# Altium schematic sheet RELAY6.SchDoc
size A
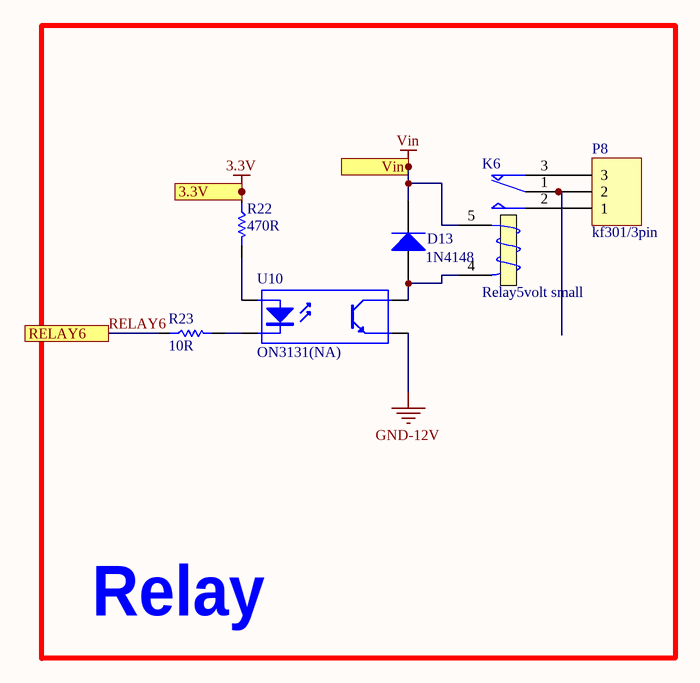
[diagram p0: RELAY6.SchDoc]

## Parts
D13  1N4148  [sod123]
K6  Relay5volt small  [relay5_childern]
P8  kf301/3pin  [Blue Connector 1*3 -kf301]
R22  470R  [0805/resistor]
R23  10R  [0805/resistor]
U10  ON3131(NA)  [OPTO_COUPLER]

## Blocks framed on the sheet
Relay: D13 K6 P8 R22 R23 U10

## Ports
3.3V, RELAY6, Vin

## Nets
3.3V: R22.1 ; port 3.3V
GND-12V: U10.3(E)
Vin: D13.K K6.5 ; port Vin
RELAY6: R23.1 ; port RELAY6
NetD13_A: D13.A K6.4(T2) U10.4(C)
NetK6_1: K6.1(COM) P8.2
NetK6_2: K6.2(NO) P8.1
NetK6_3: K6.3(T1) P8.3
NetR22_2: R22.2 U10.1(A)
NetR23_2: R23.2 U10.2(K)

## Library data of the parts
D13 = Diode 1N4007: 1 Amp General Purpose Rectifier; Published: 8-Jun-2000; LatestRevisionDate: 17-Jul-2002; LatestRevisionNote: Re-released for DXP Platform.; DatasheetVersion: 1998; PackageVersion: Aug-1999; PackageReference: DO-41; Publisher: Altium Limited; PackageDescription: Diode, Axial; Body 5.2 x 2.7 mm (LxDia. max), Lead Dia. 0.86 mm (max); Code_JEDEC: DO-204-AL; ComponentLink1Description: Manufacturer Link; ComponentLink1URL: http://www.fairchildsemi.com/; ComponentLink2Description: Datasheet; ComponentLink2URL: http://www.fairchildsemi.com/ds/1N%2F1N4001.pdf
K6 = Relay: SPDT Relay; Published: 8-Jun-2000; LatestRevisionDate: 17-Jul-2002; LatestRevisionNote: Re-released for DXP Platform.; PackageReference: MODULE5B; Publisher: Altium Limited
P8 = Header 3: LatestRevisionDate: 17-Jul-2002; LatestRevisionNote: Re-released for DXP Platform.; Publisher: Altium Limited
R22 R23 = Resistor: Tolerance: 5%; Power: 1/8 W
  R22: Value: 470R
  R23: Value: 10R
U10 = Optoisolator1: 4-Pin Phototransistor Optocoupler; Published: 24-Mar-1999; LatestRevisionDate: 04-Mar-2005; LatestRevisionNote: Sch pins 3 & 4 Swapped.; DatasheetVersion: Nov-2003; PackageReference: DIP-4; Publisher: Altium Limited